# Altium schematic sheet 底盘扩展板.SchDoc
size A0; SheetNumber: 3; SheetTotal: 3
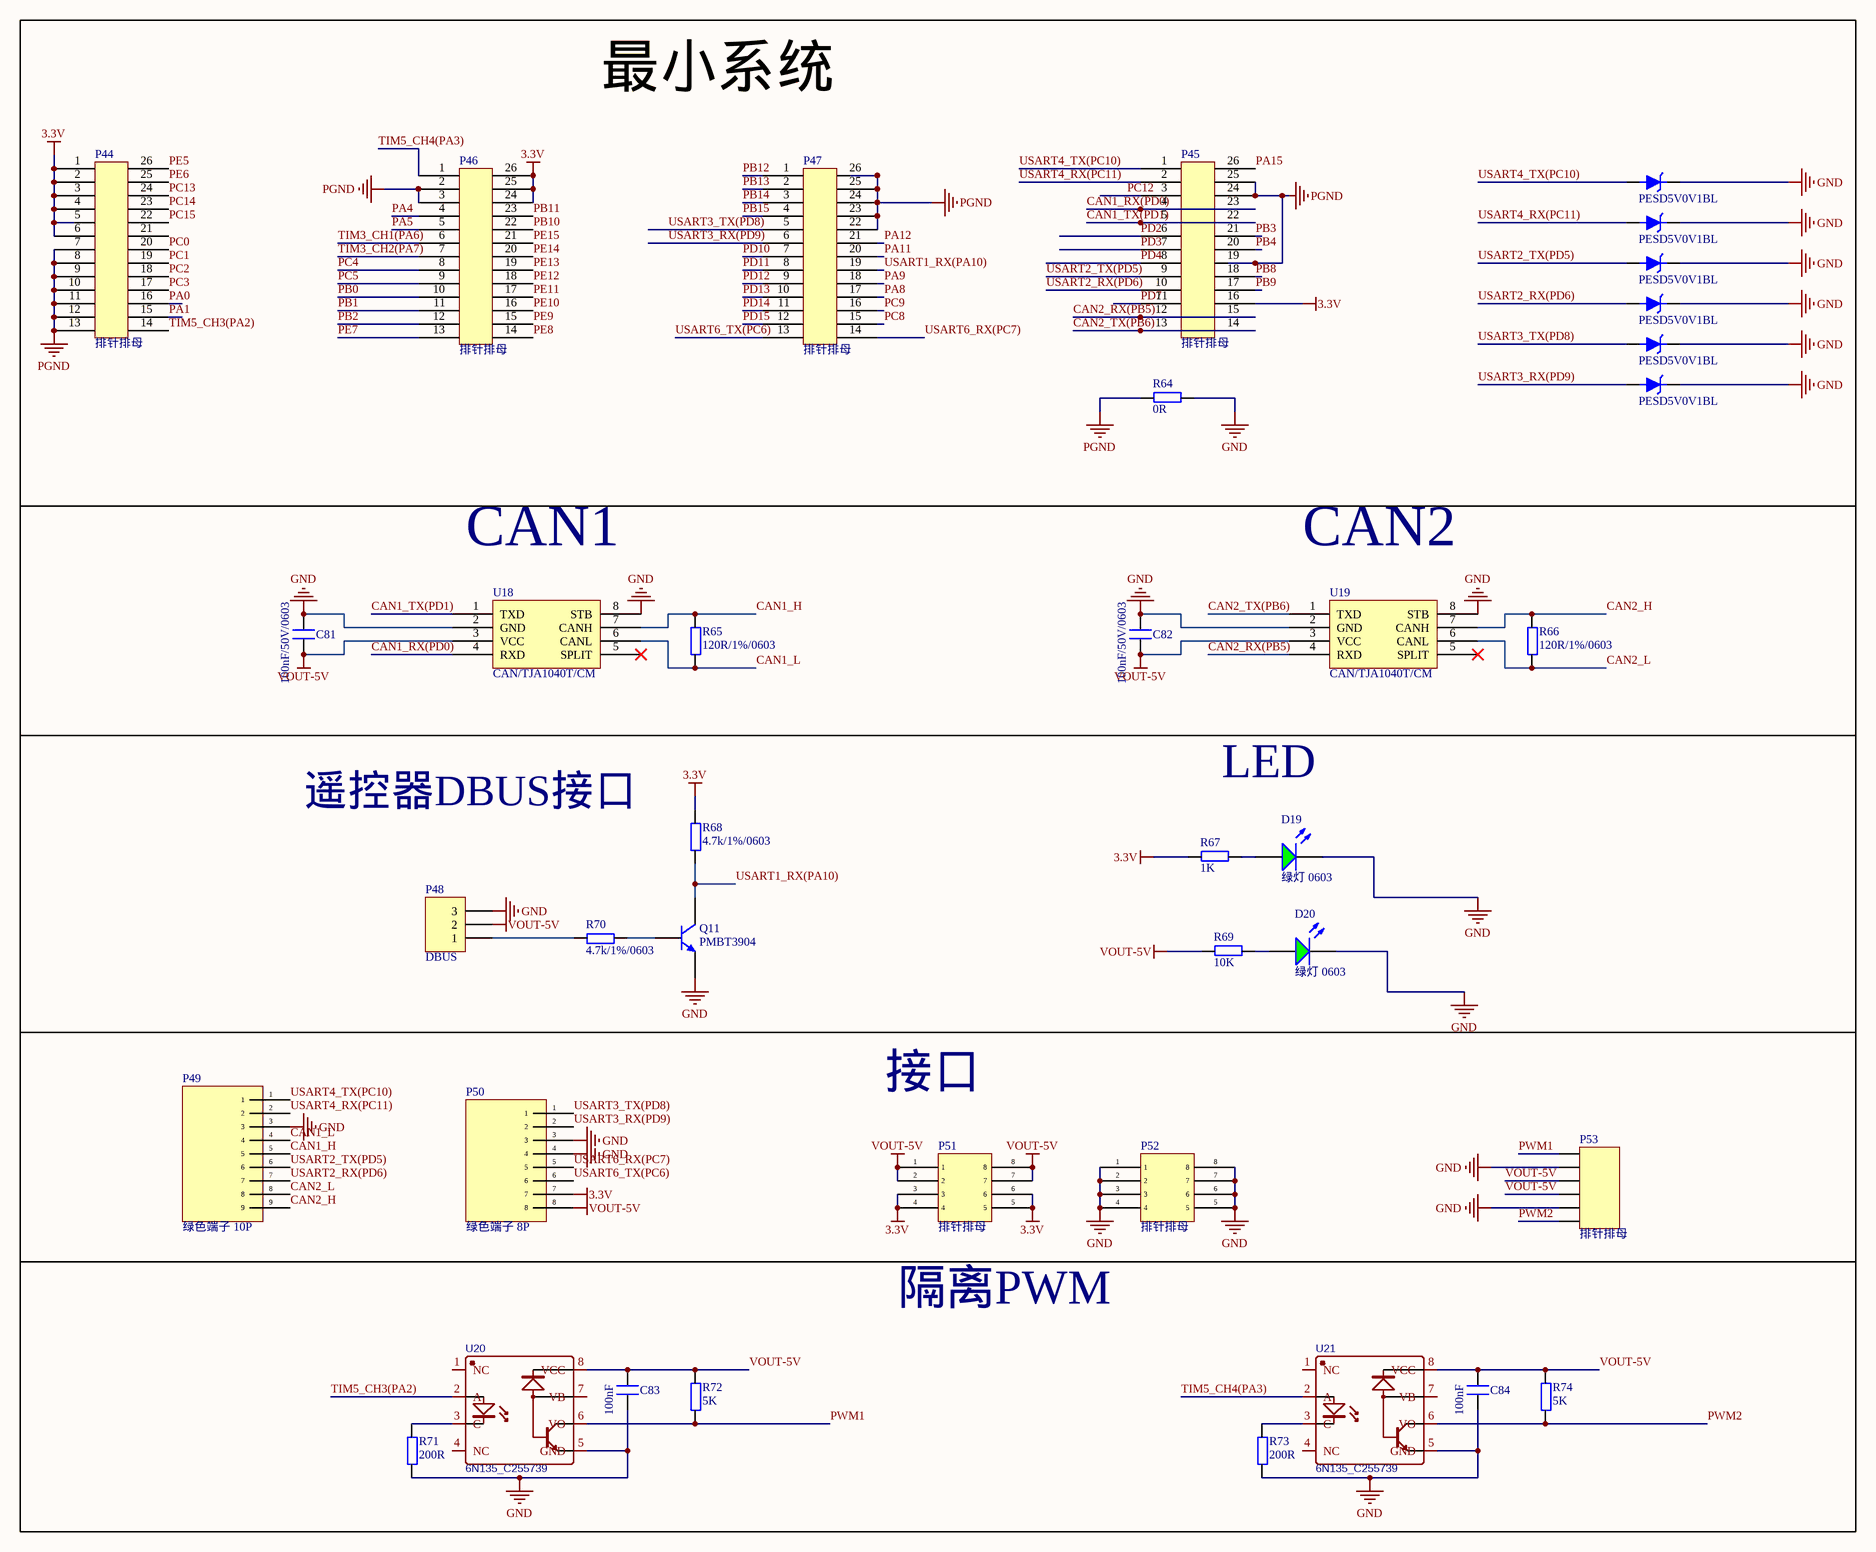
[diagram p0: 底盘扩展板.SchDoc]

## Parts
C81  100nF/50V/0603  [0603C  1   2]
C82  100nF/50V/0603  [0603C  1   2]
C83  100nF  [C0603]
C84  100nF  [C0603]
D19  绿灯 0603  [0603_LED_S1]
D20  绿灯 0603  [0603_LED_S1]
P44  排针排母  [排针 13*2 2.54 立式 -1]
P45  排针排母  [排针 13*2 2.54 立式]
P46  排针排母  [排针 13*2 2.54 立式 -2]
P47  排针排母  [排针 13*2 2.54 立式 -3]
P48  DBUS  [HDR1X3H]
P49  绿色端子 10P  [绿色端子9p]
P50  绿色端子 8P  [绿色端子8p]
P51  排针排母  [HDR-TH_16P-P2.54-V-M-R2-C8-S2.54]
P52  排针排母  [HDR-TH_16P-P2.54-V-M-R2-C8-S2.54]
P53  排针排母
Q11  PMBT3904  [SOT-23(SOT-23-3)]
R64  0R  [0603(偏大)]
R65  120R/1%/0603  [0603(偏大)]
R66  120R/1%/0603  [0603(偏大)]
R67  1K  [0603(偏大)]
R68  4.7k/1%/0603  [0603(偏大)]
R69  10K  [0603(偏大)]
R70  4.7k/1%/0603  [0603(偏大)]
R71  200R  [0603]
R72  5K  [0603]
R73  200R  [0603]
R74  5K  [0603]
T32  PESD5V0V1BL  [ESD]
T33  PESD5V0V1BL  [ESD]
T34  PESD5V0V1BL  [ESD]
T35  PESD5V0V1BL  [ESD]
T36  PESD5V0V1BL  [ESD]
T37  PESD5V0V1BL  [ESD]
U18  CAN/TJA1040T/CM  [SOIC-8_150mil]
U19  CAN/TJA1040T/CM  [SOIC-8_150mil]
U20  6N135_C255739  [光耦]
U21  6N135_C255739  [光耦]

## Nets
3.3V: P44.1 P44.2 P44.3 P44.4 P44.5 P44.6 P45.16 P46.24 P46.25 P46.26 P50.7 P51.3 P51.4 P51.5 P51.6 R67.2 R68.2
GND: C81.2 C82.2 C83.1 C84.1 D19.K D20.K P48.3 P49.3 P50.3 P50.4 P52.1 P52.2 P52.3 P52.4 P52.5 P52.6 P52.7 P52.8 P53.2 P53.5 Q11.2(E) R64.1 R71.1 R73.1 T32.2(K) T33.2(K) T34.2(K) T35.2(K) T36.2(K) T37.2(K) U18.2(GND) U18.8(STB) U19.2(GND) U19.8(STB) U20.5(GND) U21.5(GND)
PGND: P44.7 P44.8 P44.9 P44.10 P44.11 P44.12 P44.13 P45.19 P45.24 P45.25 P46.2 P46.3 P47.22 P47.23 P47.24 P47.25 P47.26 R64.2
VOUT-5V: C81.1 C82.1 C83.2 C84.2 P48.2 P50.8 P51.1 P51.2 P51.7 P51.8 P53.3 P53.4 R69.2 R72.2 R74.2 U18.3(VCC) U19.3(VCC) U20.8(VCC) U21.8(VCC)
CAN1_H: P49.5 R65.2 U18.7(CANH)
CAN1_L: P49.4 R65.1 U18.6(CANL)
CAN1_RX(PD0): P45.4 P45.23 U18.4(RXD)
CAN1_TX(PD1): P45.5 P45.22 U18.1(TXD)
CAN2_H: P49.9 R66.2 U19.7(CANH)
CAN2_L: P49.8 R66.1 U19.6(CANL)
CAN2_RX(PB5): P45.12 P45.15 U19.4(RXD)
CAN2_TX(PB6): P45.13 P45.14 U19.1(TXD)
PA0: P44.16
PA1: P44.15
PA4: P46.4
PA5: P46.5
PA8: P47.17
PA9: P47.18
PA11: P47.20
PA12: P47.21
PA15: P45.26
PB0: P46.10
PB1: P46.11
PB2: P46.12
PB3: P45.21
PB4: P45.20
PB8: P45.18
PB9: P45.17
PB10: P46.22
PB11: P46.23
PB12: P47.1
PB13: P47.2
PB14: P47.3
PB15: P47.4
PC0: P44.20
PC1: P44.19
PC2: P44.18
PC3: P44.17
PC4: P46.8
PC5: P46.9
PC8: P47.15
PC9: P47.16
PC12: P45.3
PC13: P44.24
PC14: P44.23
PC15: P44.22
PD2: P45.6
PD3: P45.7
PD4: P45.8
PD7: P45.11
PD10: P47.7
PD11: P47.8
PD12: P47.9
PD13: P47.10
PD14: P47.11
PD15: P47.12
PE5: P44.26
PE6: P44.25
PE7: P46.13
PE8: P46.14
PE9: P46.15
PE10: P46.16
PE11: P46.17
PE12: P46.18
PE13: P46.19
PE14: P46.20
PE15: P46.21
PWM1: P53.1 R72.1 U20.6(VO)
PWM2: P53.6 R74.1 U21.6(VO)
TIM3_CH1(PA6): P46.6
TIM3_CH2(PA7): P46.7
TIM5_CH3(PA2): P44.14 U20.2(A)
TIM5_CH4(PA3): P46.1 U21.2(A)
USART1_RX(PA10): P47.19 Q11.3(C) R68.1
USART2_RX(PD6): P45.10 P49.7 T35.1(A)
USART2_TX(PD5): P45.9 P49.6 T34.1(A)
USART3_RX(PD9): P47.6 P50.2 T37.1(A)
USART3_TX(PD8): P47.5 P50.1 T36.1(A)
USART4_RX(PC11): P45.2 P49.2 T33.1(A)
USART4_TX(PC10): P45.1 P49.1 T32.1(A)
USART6_RX(PC7): P47.14 P50.5
USART6_TX(PC6): P47.13 P50.6
NetD19_A: D19.A R67.1
NetD20_A: D20.A R69.1
NetP48_1: P48.1 R70.1
NetQ11_1: Q11.1(B) R70.2
NetR71_2: R71.2 U20.3(C)
NetR73_2: R73.2 U21.3(C)

Not connected (* = marked no-connect by the designer): P44 21; U18 5(SPLIT)*; U19 5(SPLIT)*; U20 1(NC) 4(NC) 7(VB); U21 1(NC) 4(NC) 7(VB)

## Notes on the sheet
- 最小系统
- CAN1
- CAN2
- LED
- 遥控器DBUS接口
- 接口
- 隔离PWM

## Library data of the parts
C81-C84 = C
D19 D20 = 0603 绿灯: 发光二极管; ComponentLink1Description: 供应商链接; ComponentLink1URL: http://www.szlcsc.com/product/details_73152.html; Package: 0603; Supplier: LC; SuppliersPartNumber: C72043
P44-P47 = 13*2排针
P48 = Header 3: Header, 3-Pin; LatestRevisionDate: 17-Jul-2002; LatestRevisionNote: Re-released for DXP Platform.; Publisher: Altium Limited
P53 = 6p排针
Q11 = SOT-23 SS8050 Y1: 三极管; ComponentLink1Description: 供应商链接; ComponentLink1URL: http://www.szlcsc.com/product/details_2507.html; Package: SOT-23; Supplier: LC; SuppliersPartNumber: C2150
R64 = R_1
R65-R74 = R
T32-T37 = ESD
U18 U19 = CAN/TJA1040T/CM_[C6951]: CAN; ComponentLink1Description: 供应商链接; ComponentLink1URL: http://www.szlcsc.com/product/details_7423.html; Package: SOIC-8_150mil; Supplier: LC; SuppliersPartNumber: C6951
U20 U21 = 6N135_C255739: BOM_Manufacturer: Isocom Components; BOM_Manufacturer Part: 6N135; Contributor: LCSC; BOM_Supplier: LCSC; BOM_Supplier Part: C255739; spicePre: U; spiceSymbolName: 6N135_C255739